# EasyEDA schematic Schematic.json
TITLE: HOME AUTOMATION; REV: 1.0; Date: 2021-04-23; Sheet: 1/1; Company: SCINTILLA
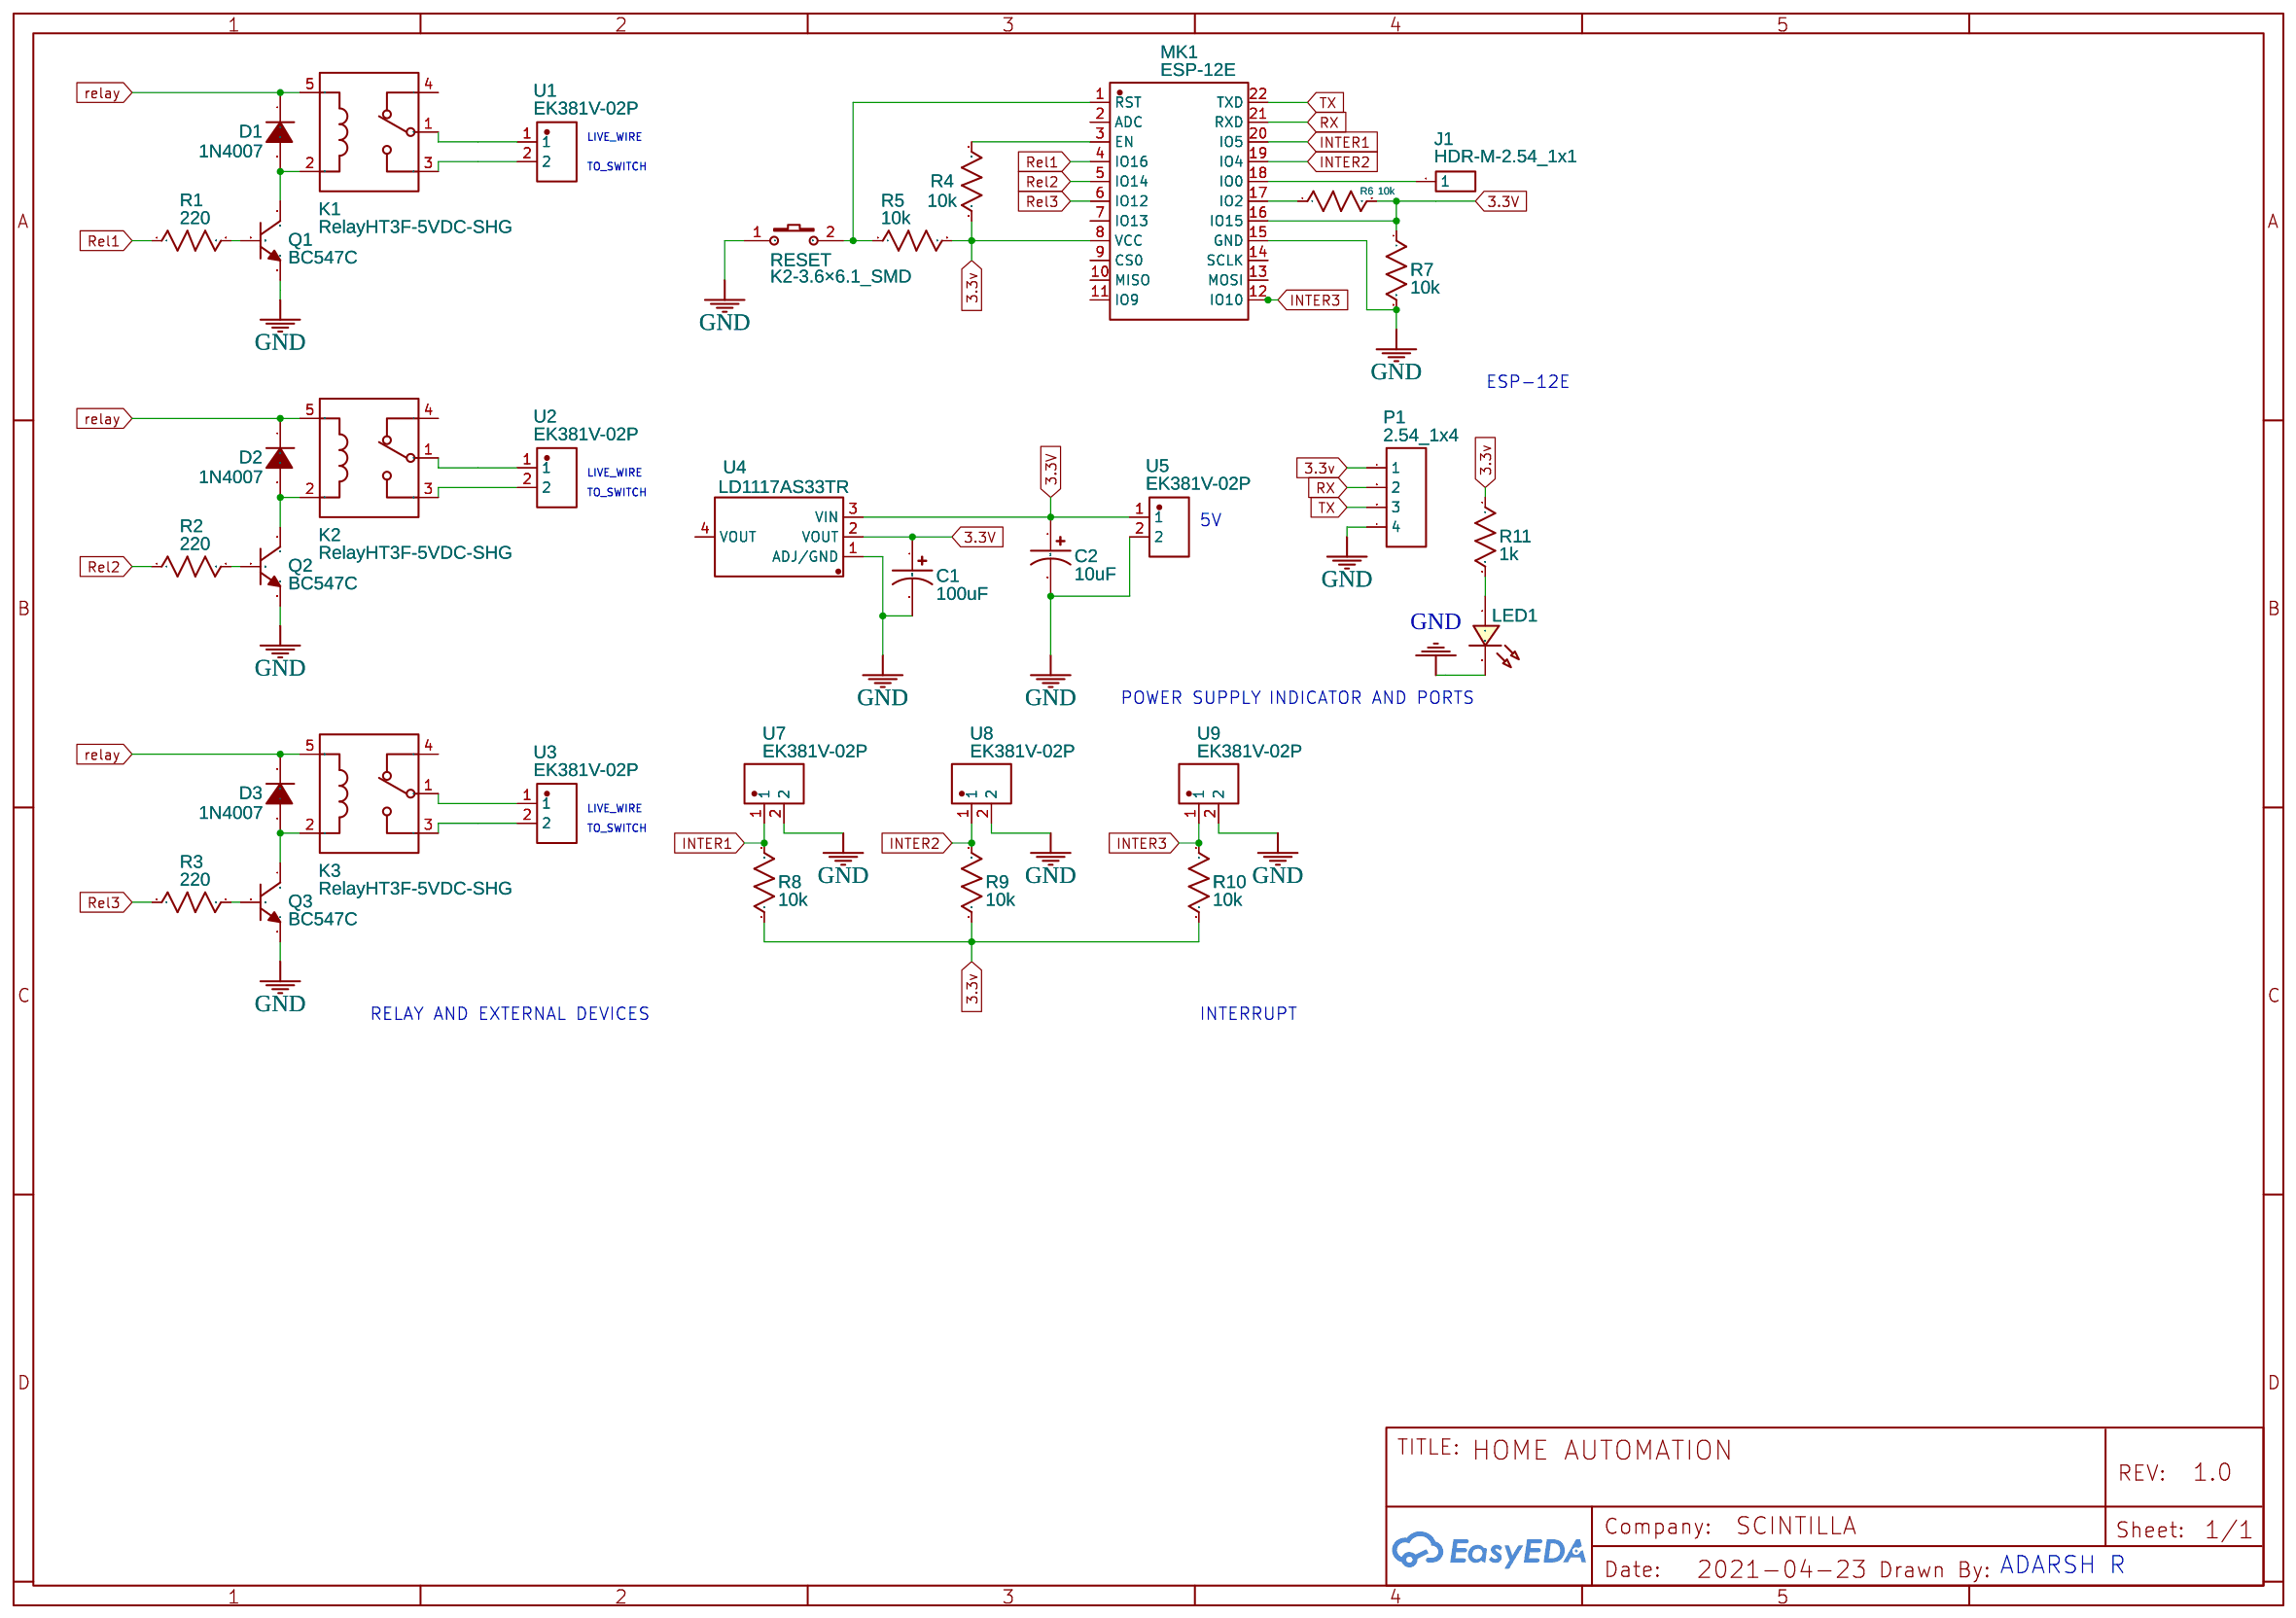
[diagram p0: schematic sheet]

## Parts
C1  100uF  [CAPACITOR_SMD2512_HANDSOLDERING_REVA_DATE21JUN2010]
C2  10uF  [CAPACITOR_SMD2512_HANDSOLDERING_REVA_DATE21JUN2010]
D1  1N4007  [SMD-5032_2P]
D2  1N4007  [SMD-5032_2P]
D3  1N4007  [SMD-5032_2P]
J1  HDR-M-2.54_1x1  [HDR-M-2.54_1X1]
K1  RelayHT3F-5VDC-SHG  [RELAY-TH_HT3F-DCXX-X-X]
K2  RelayHT3F-5VDC-SHG  [RELAY-TH_HT3F-DCXX-X-X]
K3  RelayHT3F-5VDC-SHG  [RELAY-TH_HT3F-DCXX-X-X]
LED1  LED-0603_R  [LED0402-R-RD]
MK1  ESP-12E  [WIFIM-SMD_ESP-12E]
P1  2.54_1x4  [HDR-4X1/2.54]
Q1  BC547C  [TO-92-3_L4.9-W3.7-P1.27-L]
Q2  BC547C  [TO-92-3_L4.9-W3.7-P1.27-L]
Q3  BC547C  [TO-92-3_L4.9-W3.7-P1.27-L]
R1  220  [RESISTOR_SMDUNIVERSAL_0805TO2512_HANDSOLDERING]
R2  220  [RESISTOR_SMDUNIVERSAL_0805TO2512_HANDSOLDERING]
R3  220  [RESISTOR_SMDUNIVERSAL_0805TO2512_HANDSOLDERING]
R4  10k  [RESISTOR_SMDUNIVERSAL_0805TO2512_HANDSOLDERING]
R5  10k  [RESISTOR_SMDUNIVERSAL_0805TO2512_HANDSOLDERING]
R6  10k  [RESISTOR_SMDUNIVERSAL_0805TO2512_HANDSOLDERING]
R7  10k  [RESISTOR_SMDUNIVERSAL_0805TO2512_HANDSOLDERING]
R8  10k  [RESISTOR_SMDUNIVERSAL_0805TO2512_HANDSOLDERING]
R9  10k  [RESISTOR_SMDUNIVERSAL_0805TO2512_HANDSOLDERING]
R10  10k  [RESISTOR_SMDUNIVERSAL_0805TO2512_HANDSOLDERING]
R11  1k  [RESISTOR_SMDUNIVERSAL_0805TO2512_HANDSOLDERING]
RESET  K2-3.6×6.1_SMD  [KEY-SMD_2P-L6.2-W3.6-LS8.0]
U1  EK381V-02P  [CONN-TH_2P-P3.81_L7.4-W7.6-DE4.0]
U2  EK381V-02P  [CONN-TH_2P-P3.81_L7.4-W7.6-DE4.0]
U3  EK381V-02P  [CONN-TH_2P-P3.81_L7.4-W7.6-DE4.0]
U4  LD1117AS33TR  [SOT-223-4_L6.5-W3.5-P2.30-LS7.0-BR]
U5  EK381V-02P  [CONN-TH_2P-P3.81_L7.4-W7.6-DE4.0]
U7  EK381V-02P  [CONN-TH_2P-P3.81_L7.4-W7.6-DE4.0]
U8  EK381V-02P  [CONN-TH_2P-P3.81_L7.4-W7.6-DE4.0]
U9  EK381V-02P  [CONN-TH_2P-P3.81_L7.4-W7.6-DE4.0]

## Library data of the parts
C1 C2 = C_Tan_SMD_A_US: Contributor: LCEDA_Lib
D1-D3 = 1N4007: Supplier: LCSC; Manufacturer: SEMTECH; Supplier Part: C106903; JLCPCB Part Class: Extended Part
J1 = HDR-M-2.54_1x1: Supplier Part: C81276; Supplier: LCSC; Contributor: Ashok Kumar
K1-K3 = RelayHT3F-12VDC-SHG: Supplier: LCSC; Manufacturer: HTV; image: //image.lceda.cn/szlcsc/C22022.jpg; Supplier Part: C22022; JLCPCB Part Class: Extended Part
LED1 = LED-0603_R: Manufacturer: EVERLIGHT(台湾亿光); Manufacturer Part: 19-217/R6C-AL1M2VY/3T; Supplier Part: C72044; Supplier: LCSC; Contributor: LCEDA_01
MK1 = ESP-12E: Supplier: LCSC; Manufacturer: Ai-Thinker; Supplier Part: C89297
P1 = Header-Female-2.54_1x4: Supplier: LCSC; Manufacturer: ReliaPro; Supplier Part: C124413
Q1-Q3 = BC547C: Supplier: LCSC; Supplier Part: C713614; Manufacturer: LGE; Contributor: LCSC; JLCPCB Part Class: Extended Part
R1-R3 R5-R11 = R_0603_US: Contributor: LCEDA_Lib
R4 = R_0603_US: Contributor: LCEDA_Lib; Package Display: No
RESET = K2-3.6×6.1_SMD: Supplier Part: C118141; Supplier: LCSC; Manufacturer Part: K2-1107ST-A4SW-06; Contributor: Parves; 制造商: 韩国韩荣
U1-U3 U5 U7-U9 = EK381V-02P: Supplier: LCSC; Supplier Part: C192645; Manufacturer: Dinkle; Contributor: LCSC; JLCPCB Part Class: Extended Part
U4 = LD1117AS33TR: Supplier: LCSC; Supplier Part: C115288; Manufacturer: STMicroelectronics; Contributor: LCSC; JLCPCB Part Class: Extended Part

## Nets
3.3v: MK1.8(VCC) P1.1 R4.1 R5.2 R8.1 R9.1 R10.2 R11.1
3.3V: C1.1 C2.1 MK1.16(IO15) R6.2 R7.1 U4.2(VOUT) U4.3(VIN) U5.1
GND: C1.2 C2.2 LED1.2 MK1.15(GND) P1.4 Q1.3(E) Q2.3(E) Q3.3(E) R7.2 RESET.1 U4.1(ADJ/GND) U5.2 U7.2 U8.2 U9.2
INTER1: MK1.20(IO5) R8.2 U7.1
INTER2: MK1.19(IO4) R9.2 U8.1
INTER3: MK1.12(IO10) R10.1 U9.1
Rel1: MK1.4(IO16) R1.1
Rel2: MK1.5(IO14) R2.1
Rel3: MK1.6(IO12) R3.1
relay: D1.1(K) D2.1(K) D3.1(K) K1.5 K2.5 K3.5
RX: MK1.21(RXD) P1.2
TX: MK1.22(TXD) P1.3
Net-(D1-2): D1.2(A) K1.2 Q1.1(C)
Net-(D2-2): D2.2(A) K2.2 Q2.1(C)
Net-(D3-2): D3.2(A) K3.2 Q3.1(C)
Net-(J1-1): J1.1 MK1.18(IO0)
Net-(K1-1): K1.1 U1.1
Net-(K1-3): K1.3 U1.2
Net-(K2-1): K2.1 U2.1
Net-(K2-3): K2.3 U2.2
Net-(K3-1): K3.1 U3.1
Net-(K3-3): K3.3 U3.2
Net-(LED1-1): LED1.1 R11.2
Net-(MK1-1): MK1.1(RST) R5.1 RESET.2
Net-(MK1-3): MK1.3(EN) R4.2
Net-(MK1-17): MK1.17(IO2) R6.1
Net-(Q1-2): Q1.2(B) R1.2
Net-(Q2-2): Q2.2(B) R2.2
Net-(Q3-2): Q3.2(B) R3.2

Not connected (* = marked no-connect by the designer): K1 4; K2 4; K3 4; MK1 2(ADC) 7(IO13) 9(CS0) 10(MISO) 11(IO9) 13(MOSI) 14(SCLK); U4 4(VOUT)

## Notes on the sheet
- LIVE_WIRE
- TO_SWITCH
- ESP-12E
- LIVE_WIRE
- TO_SWITCH
- 5V
- POWER SUPPLY
- INDICATOR AND PORTS
- LIVE_WIRE
- TO_SWITCH
- RELAY AND EXTERNAL DEVICES
- INTERRUPT
- ADARSH R
